# Altium schematic sheet Practica 8 - LCD.SchDoc
size Legal; Engineer: Roberto Isaac Suaste Martinez; Organization: Mecatronica Digital; Address1: www.mecatronicadigital.com; Address2: info@mecatronicadigital.com; Address3: Dpto. Diseño Electronico
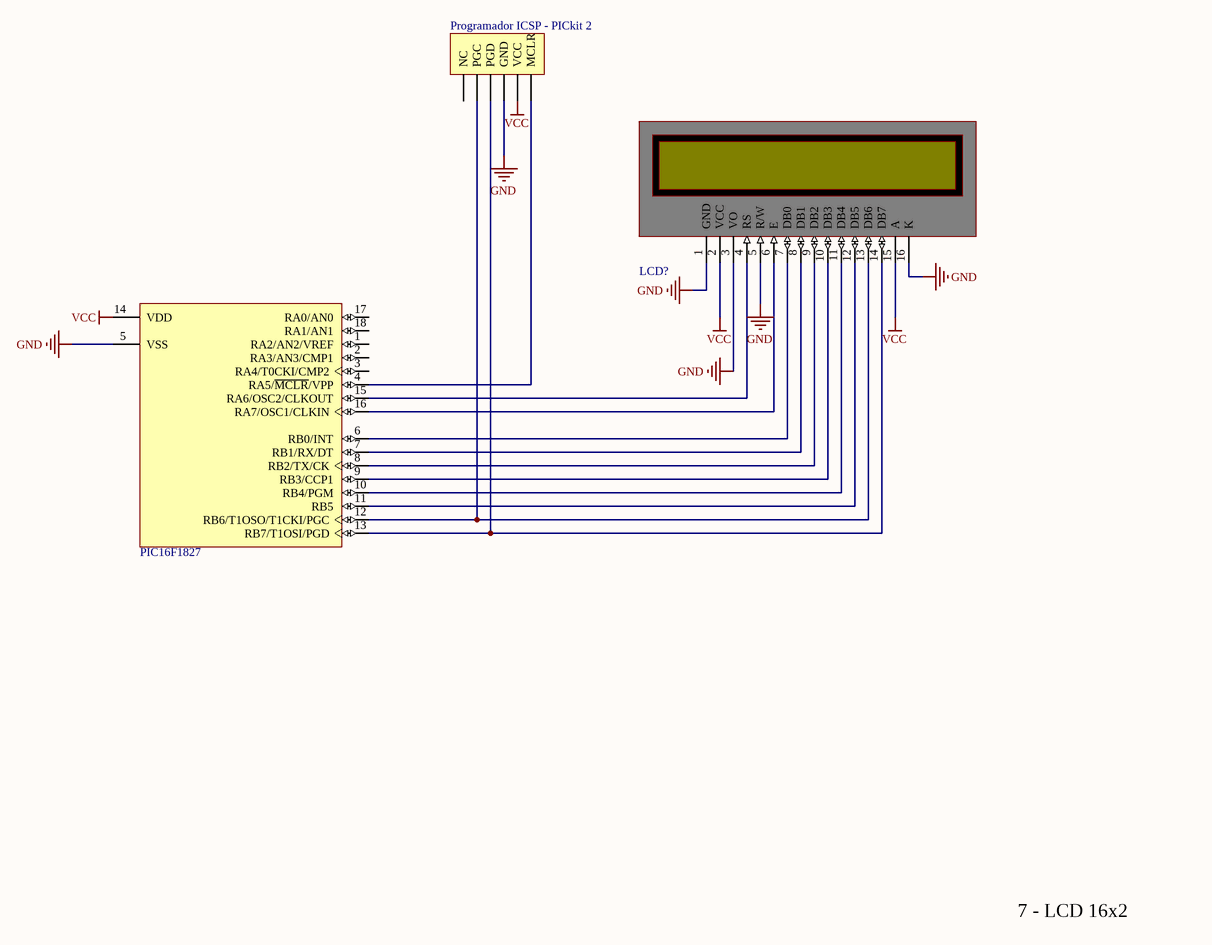
[diagram p0: Practica 8 - LCD.SchDoc]

## Parts
LCD?  LCD 16X2  [LCD 16x2-A]  (value not drawn)
Programador_ICSP_-_PICkit_2  Header 6  [Header 1X6]  (value not drawn)
U?  PIC16F1827  [PDIP300-P18]

## Nets
GND: LCD?.1(GND) LCD?.3(VO) LCD?.5(R/W) LCD?.16(K) Programador_ICSP_-_PICkit_2.3(GND) U?.5(VSS)
VCC: LCD?.2(VCC) LCD?.15(A) Programador_ICSP_-_PICkit_2.2(VCC) U?.14(VDD)
NetLCD?_4: LCD?.4(RS) U?.15(RA6/OSC2/CLKOUT)
NetLCD?_6: LCD?.6(E) U?.16(RA7/OSC1/CLKIN)
NetLCD?_7: LCD?.7(DB0) U?.6(RB0/INT)
NetLCD?_8: LCD?.8(DB1) U?.7(RB1/RX/DT)
NetLCD?_9: LCD?.9(DB2) U?.8(RB2/TX/CK)
NetLCD?_10: LCD?.10(DB3) U?.9(RB3/CCP1)
NetLCD?_11: LCD?.11(DB4) U?.10(RB4/PGM)
NetLCD?_12: LCD?.12(DB5) U?.11(RB5)
NetLCD?_13: LCD?.13(DB6) Programador_ICSP_-_PICkit_2.5(PGC) U?.12(RB6/T1OSO/T1CKI/PGC)
NetLCD?_14: LCD?.14(DB7) Programador_ICSP_-_PICkit_2.4(PGD) U?.13(RB7/T1OSI/PGD)
NetProgramador_ICSP_-_PICkit_2_1: Programador_ICSP_-_PICkit_2.1(MCLR) U?.4(RA5/~{MCLR}/VPP)

Not connected (* = marked no-connect by the designer): Programador_ICSP_-_PICkit_2 6(NC); U? 1(RA2/AN2/VREF) 2(RA3/AN3/CMP1) 3(RA4/T0CKI/CMP2) 17(RA0/AN0) 18(RA1/AN1)

## Notes on the sheet
- 7 - LCD 16x2
- Proyecto:
- Practica
- Ingeniero:
- Size:
- Fecha:
- A4
- Documento Numero:
- Hora:
- Revision:

## Library data of the parts
LCD? = LCD 16X2: LCD 16X2 Character lcd
Programador_ICSP_-_PICkit_2 = Header 6: Header, 6-Pin; LatestRevisionDate: 17-Jul-2002; LatestRevisionNote: Re-released for DXP Platform.; Publisher: Altium Limited
U? = PIC16F628A-I/P: FLASH-Based 8-Bit CMOS Microcontroller with nanoWatt Technology, 2K (x14-Bit words) FLASH, 224 Bytes SRAM, 18-Pin PDIP, 3.0 to 5.5V Supply Range, Industrial Temperature; Published: 11-Oct-2004; LatestRevisionDate: 29-Jan-2009; LatestRevisionNote: Sch. layout revised. 3D Model Removed.; DatasheetVersion: revF, Mar-2007; PackageVersion: revBB, Aug-2009; PackageReference: PDIP300-P18; Publisher: Altium Limited; PackageDescription: 18-Lead Plastic Dual In-Line (P) - 300 mil Body [PDIP]; Supplier 1: Digi-Key; Supplier Part Number 1: PIC16F628A-I/P-ND; Supplier 2: Farnell; Supplier Part Number 2: 9771549; Supplier 3: Farnell; Supplier Part Number 3: 1523938; Supplier 4: Farnell; Supplier Part Number 4: 9760423; Code_JEDEC: MS-001; ComponentLink1Description: Datasheet; ComponentLink1URL: http://ww1.microchip.com/downloads/en/DeviceDoc/40044F.pdf; ComponentLink2Description: Packaging Specification; ComponentLink2URL: http://www.microchip.com/stellent/groups/techpub_sg/documents/packagingspec/en012702.pdf; ComponentLink3Description: Microchip.com Home; ComponentLink3URL: http://www.microchip.com/